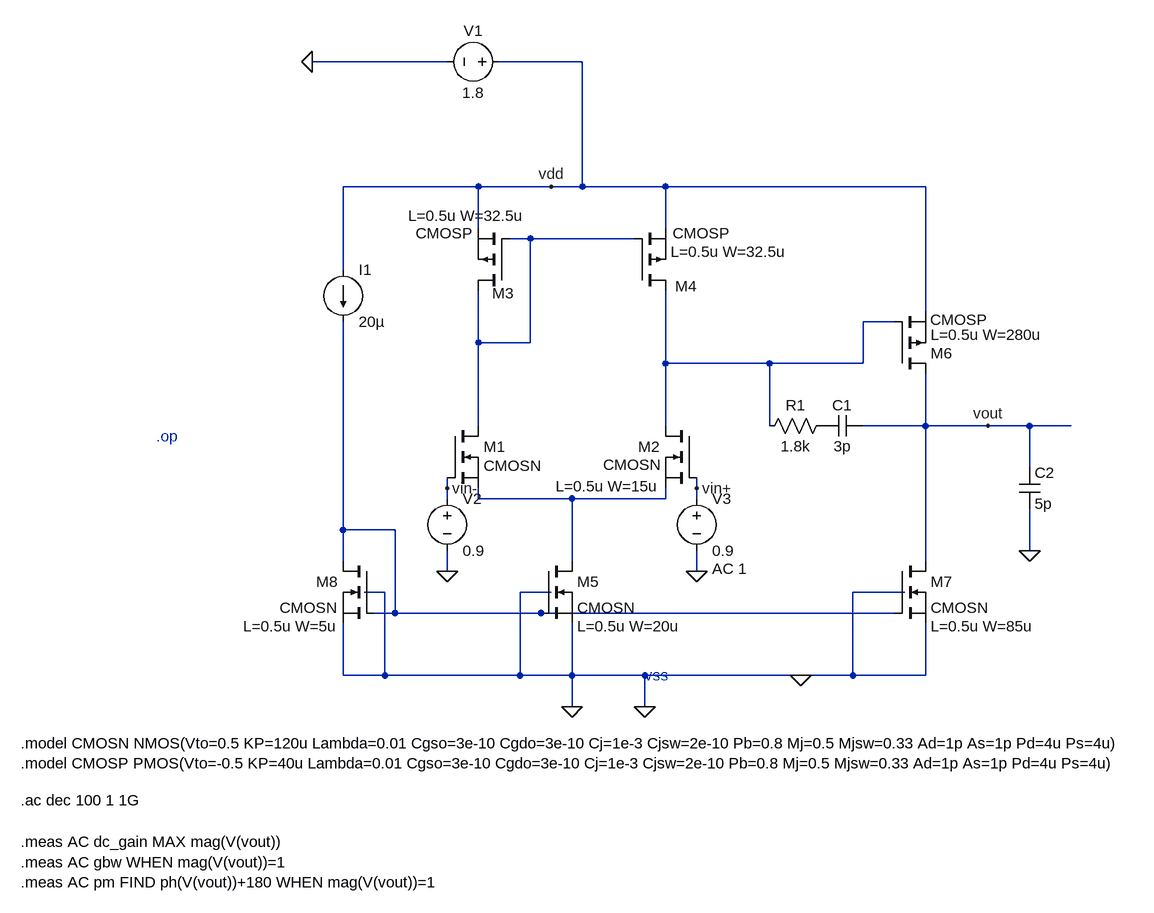
[diagram p0: schematic 2 stage cmos opamp.asc]
2 stage cmos opamp.asc, the LTspice schematic file:
Version 4.1
SHEET 1 2872 680
WIRE -112 -672 -320 -672
WIRE 96 -672 -32 -672
WIRE -64 -480 -272 -480
WIRE 48 -480 -64 -480
WIRE 96 -480 96 -672
WIRE 96 -480 48 -480
WIRE 224 -480 96 -480
WIRE 624 -480 224 -480
WIRE -64 -416 -64 -480
WIRE 224 -416 224 -480
WIRE 16 -400 -16 -400
WIRE 176 -400 16 -400
WIRE -272 -352 -272 -480
WIRE 624 -288 624 -480
WIRE 576 -272 528 -272
WIRE -64 -240 -64 -320
WIRE 16 -240 16 -400
WIRE 16 -240 -64 -240
WIRE 224 -208 224 -320
WIRE 384 -208 224 -208
WIRE 528 -208 528 -272
WIRE 528 -208 384 -208
WIRE -64 -112 -64 -240
WIRE 224 -112 224 -208
WIRE 384 -112 384 -208
WIRE 624 -112 624 -192
WIRE 624 -112 528 -112
WIRE 720 -112 624 -112
WIRE 784 -112 720 -112
WIRE 848 -112 784 -112
WIRE 784 -48 784 -112
WIRE -112 -16 -112 -32
WIRE 272 -16 272 -32
WIRE -112 0 -112 -16
WIRE -64 0 -64 -16
WIRE 80 0 -64 0
WIRE 224 0 224 -16
WIRE 224 0 80 0
WIRE 272 0 272 -16
WIRE -272 48 -272 -272
WIRE -192 48 -272 48
WIRE 784 80 784 16
WIRE -272 96 -272 48
WIRE 80 96 80 0
WIRE 624 96 624 -112
WIRE -112 112 -112 80
WIRE 272 112 272 80
WIRE -208 144 -240 144
WIRE 48 144 0 144
WIRE 592 144 512 144
WIRE -192 176 -192 48
WIRE -192 176 -224 176
WIRE 32 176 -192 176
WIRE 576 176 32 176
WIRE -272 272 -272 192
WIRE -208 272 -208 144
WIRE -208 272 -272 272
WIRE 0 272 0 144
WIRE 0 272 -208 272
WIRE 80 272 80 192
WIRE 80 272 0 272
WIRE 192 272 80 272
WIRE 432 272 192 272
WIRE 512 272 512 144
WIRE 512 272 432 272
WIRE 624 272 624 192
WIRE 624 272 512 272
WIRE 80 320 80 272
WIRE 192 320 192 272
FLAG 784 80 0
FLAG -112 112 0
FLAG 272 112 0
FLAG 432 272 0
FLAG -320 -672 0
FLAG 80 320 0
FLAG 192 320 0
FLAG 720 -112 vout
FLAG -112 -16 vin-
FLAG 272 -16 vin+
FLAG 48 -480 vdd
SYMBOL nmos -112 -112 R0
WINDOW 3 56 61 Left 2
SYMATTR InstName M1
SYMATTR Value CMOSN
SYMATTR Value2 L=0.5u W=15u
SYMBOL nmos 272 -112 M0
WINDOW 3 55 60 Left 2
WINDOW 123 58 93 Left 2
SYMATTR InstName M2
SYMATTR Value CMOSN
SYMATTR Value2 L=0.5u W=15u
SYMBOL pmos -16 -320 R180
WINDOW 0 -7 -4 Left 2
WINDOW 3 57 88 Left 2
WINDOW 123 -23 115 Left 2
SYMATTR InstName M3
SYMATTR Value CMOSP
SYMATTR Value2 L=0.5u W=32.5u
SYMBOL pmos 176 -320 M180
WINDOW 0 63 7 Left 2
WINDOW 3 59 88 Left 2
WINDOW 123 56 60 Left 2
SYMATTR InstName M4
SYMATTR Value CMOSP
SYMATTR Value2 L=0.5u W=32.5u
SYMBOL nmos 32 96 R0
WINDOW 123 56 100 Left 2
SYMATTR InstName M5
SYMATTR Value CMOSN
SYMATTR Value2 L=0.5u W=20u
SYMBOL pmos 576 -192 M180
WINDOW 3 55 83 Left 2
WINDOW 123 56 60 Left 2
SYMATTR InstName M6
SYMATTR Value CMOSP
SYMATTR Value2 L=0.5u W=280u
SYMBOL nmos 576 96 R0
WINDOW 123 56 100 Left 2
SYMATTR InstName M7
SYMATTR Value CMOSN
SYMATTR Value2 L=0.5u W=85u
SYMBOL nmos -224 96 M0
WINDOW 123 56 100 Left 2
SYMATTR InstName M8
SYMATTR Value CMOSN
SYMATTR Value2 L=0.5u W=5u
SYMBOL cap 528 -128 R90
WINDOW 0 0 32 VBottom 2
WINDOW 3 32 32 VTop 2
SYMATTR InstName C1
SYMATTR Value 3p
SYMBOL cap 768 -48 R0
SYMATTR InstName C2
SYMATTR Value 5p
SYMBOL res 480 -128 R90
WINDOW 0 0 56 VBottom 2
WINDOW 3 32 56 VTop 2
SYMATTR InstName R1
SYMATTR Value 1.8k
SYMBOL voltage -112 -16 R0
WINDOW 123 0 0 Left 0
WINDOW 39 0 0 Left 0
SYMATTR InstName V2
SYMATTR Value 0.9
SYMBOL voltage 272 -16 R0
WINDOW 123 24 124 Left 2
WINDOW 39 0 0 Left 0
SYMATTR InstName V3
SYMATTR Value 0.9
SYMATTR Value2 AC 1
SYMBOL current -272 -352 R0
WINDOW 123 0 0 Left 0
WINDOW 39 0 0 Left 0
SYMATTR InstName I1
SYMATTR Value 20µ
SYMBOL voltage -16 -672 R90
WINDOW 0 -32 56 VBottom 2
WINDOW 3 32 56 VTop 2
WINDOW 123 0 0 Left 0
WINDOW 39 0 0 Left 0
SYMATTR InstName V1
SYMATTR Value 1.8
TEXT 192 272 Left 2 ;vss
TEXT -768 376 Left 2 !.model CMOSN NMOS(Vto=0.5 KP=120u Lambda=0.01 Cgso=3e-10 Cgdo=3e-10 Cj=1e-3 Cjsw=2e-10 Pb=0.8 Mj=0.5 Mjsw=0.33 Ad=1p As=1p Pd=4u Ps=4u)\n.model CMOSP PMOS(Vto=-0.5 KP=40u Lambda=0.01 Cgso=3e-10 Cgdo=3e-10 Cj=1e-3 Cjsw=2e-10 Pb=0.8 Mj=0.5 Mjsw=0.33 Ad=1p As=1p Pd=4u Ps=4u)
TEXT -768 464 Left 2 !.ac dec 100 1 1G
TEXT -768 528 Left 2 !.meas AC dc_gain MAX mag(V(vout))\n.meas AC gbw WHEN mag(V(vout))=1\n.meas AC pm FIND ph(V(vout))+180 WHEN mag(V(vout))=1
TEXT -560 -96 Left 2 ;.op

The netlist it stands for:
* 2 stage cmos opamp.asc
M1 N001 vin- N003 N003 CMOSN L=0.5u W=15u
M2 N002 vin+ N003 N003 CMOSN L=0.5u W=15u
M3 N001 N001 vdd vdd CMOSP L=0.5u W=32.5u
M4 N002 N001 vdd vdd CMOSP L=0.5u W=32.5u
M5 N003 N004 0 0 CMOSN L=0.5u W=20u
M6 vout N002 vdd vdd CMOSP L=0.5u W=280u
M7 vout N004 0 0 CMOSN L=0.5u W=85u
M8 N004 N004 0 0 CMOSN L=0.5u W=5u
C1 vout P001 3p
C2 vout 0 5p
R1 P001 N002 1.8k
V2 vin- 0 0.9
V3 vin+ 0 0.9 AC 1
I1 vdd N004 20µ
V1 vdd 0 1.8
.model NMOS NMOS
.model PMOS PMOS
.lib standard.mos
* vss
.model CMOSN NMOS(Vto=0.5 KP=120u Lambda=0.01 Cgso=3e-10 Cgdo=3e-10 Cj=1e-3 Cjsw=2e-10 Pb=0.8 Mj=0.5 Mjsw=0.33 Ad=1p As=1p Pd=4u Ps=4u)
.model CMOSP PMOS(Vto=-0.5 KP=40u Lambda=0.01 Cgso=3e-10 Cgdo=3e-10 Cj=1e-3 Cjsw=2e-10 Pb=0.8 Mj=0.5 Mjsw=0.33 Ad=1p As=1p Pd=4u Ps=4u)
.ac dec 100 1 1G
.meas AC dc_gain MAX mag(V(vout))
.meas AC gbw WHEN mag(V(vout))=1
.meas AC pm FIND ph(V(vout))+180 WHEN mag(V(vout))=1
* .op
.backanno
.end